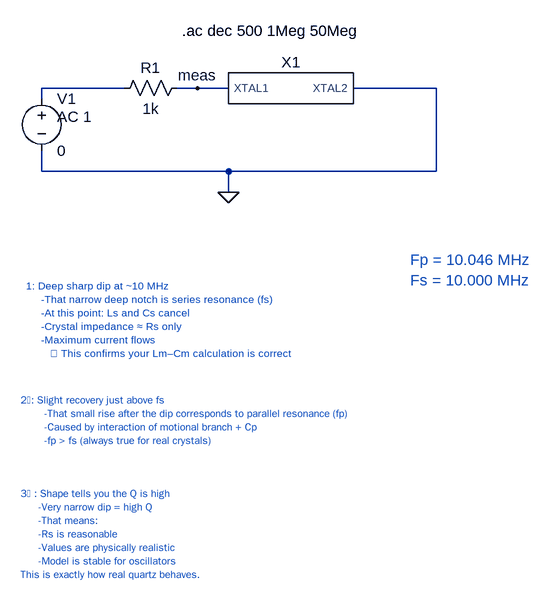
[diagram p0: schematic XTAL_10MHz_BVD__testing_AC_analysis.asc]
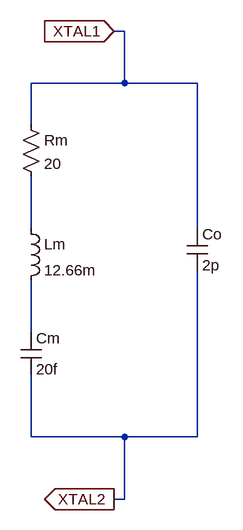
[diagram p1: sub-circuit xtal_10mhz_bvd.asc]
XTAL_10MHz_BVD__testing_AC_analysis.asc, the LTspice schematic file:
Version 4.1
SHEET 1 880 680
WIRE -1200 -1184 -1328 -1184
WIRE -1088 -1184 -1120 -1184
WIRE -1040 -1184 -1088 -1184
WIRE -720 -1184 -848 -1184
WIRE -1328 -1168 -1328 -1184
WIRE -1328 -1056 -1328 -1088
WIRE -1040 -1056 -1328 -1056
WIRE -720 -1056 -720 -1184
WIRE -720 -1056 -1040 -1056
WIRE -1040 -1024 -1040 -1056
FLAG -1040 -1024 0
FLAG -1088 -1184 meas
SYMBOL XTAL_10MHz_BVD -944 -1184 R0
SYMATTR InstName X1
SYMBOL voltage -1328 -1184 R0
WINDOW 123 24 44 Left 2
WINDOW 39 0 0 Left 0
SYMATTR InstName V1
SYMATTR Value 0
SYMATTR Value2 AC 1
SYMBOL res -1104 -1200 R90
WINDOW 0 0 56 VBottom 2
WINDOW 3 32 56 VTop 2
SYMATTR InstName R1
SYMATTR Value 1k
TEXT -1112 -1272 Left 2 !.ac dec 500 1Meg 50Meg
TEXT -1352 -880 Left 1 ;1: Deep sharp dip at ~10 MHz\n     -That narrow deep notch is series resonance (fs)\n     -At this point: Ls and Cs cancel\n     -Crystal impedance ≈ Rs only\n     -Maximum current flows\n        ✔ This confirms your Lm–Cm calculation is correct
TEXT -1360 -704 Left 1 ;2️: Slight recovery just above fs\n        -That small rise after the dip corresponds to parallel resonance (fp)\n        -Caused by interaction of motional branch + Cp\n        -fp > fs (always true for real crystals)
TEXT -1360 -560 Left 1 ;3️ : Shape tells you the Q is high\n      -Very narrow dip = high Q\n      -That means:\n      -Rs is reasonable\n      -Values are physically realistic\n      -Model is stable for oscillators\nThis is exactly how real quartz behaves.
TEXT -760 -920 Left 2 ;Fp = 10.046 MHz\nFs = 10.000 MHz

xtal_10mhz_bvd.asc, the sub-circuit schematic file:
Version 4.1
SHEET 1 880 712
WIRE 304 -80 288 -80
WIRE 304 0 304 -80
WIRE 304 0 160 0
WIRE 416 0 304 0
WIRE 160 64 160 0
WIRE 160 224 160 144
WIRE 416 224 416 0
WIRE 160 384 160 304
WIRE 160 544 160 448
WIRE 304 544 160 544
WIRE 416 544 416 288
WIRE 416 544 304 544
WIRE 304 640 304 544
WIRE 304 640 288 640
FLAG 288 -80 XTAL1
IOPIN 288 -80 In
FLAG 288 640 XTAL2
IOPIN 288 640 Out
SYMBOL res 144 48 R0
SYMATTR InstName Rm
SYMATTR Value 20
SYMBOL ind 144 208 R0
SYMATTR InstName Lm
SYMATTR Value 12.66m
SYMBOL cap 144 384 R0
SYMATTR InstName Cm
SYMATTR Value 20f
SYMBOL cap 400 224 R0
SYMATTR InstName Co
SYMATTR Value 2p

The netlist it stands for:
* XTAL_10MHz_BVD__testing_AC_analysis.asc
X§X1 meas 0 xtal_10mhz_bvd
V1 N001 0 0 AC 1
R1 meas N001 1k

* block symbol definitions
.subckt xtal_10mhz_bvd XTAL1 XTAL2
Rm XTAL1 N001 20
Lm N001 N002 12.66m
Cm N002 XTAL2 20f
Co XTAL1 XTAL2 2p
.ends xtal_10mhz_bvd

.ac dec 500 1Meg 50Meg
* 1: Deep sharp dip at ~10 MHz
*      -That narrow deep notch is series resonance (fs)
*      -At this point: Ls and Cs cancel
*      -Crystal impedance ≈ Rs only
*      -Maximum current flows
*         ✔ This confirms your Lm–Cm calculation is correct
* 2️: Slight recovery just above fs
*         -That small rise after the dip corresponds to parallel resonance (fp)
*         -Caused by interaction of motional branch + Cp
*         -fp > fs (always true for real crystals)
* 3️ : Shape tells you the Q is high
*       -Very narrow dip = high Q
*       -That means:
*       -Rs is reasonable
*       -Values are physically realistic
*       -Model is stable for oscillators
* This is exactly how real quartz behaves.
* Fp = 10.046 MHz
* Fs = 10.000 MHz
.backanno
.end

* Results of the author's LTspice run, read from the files saved beside the schematic
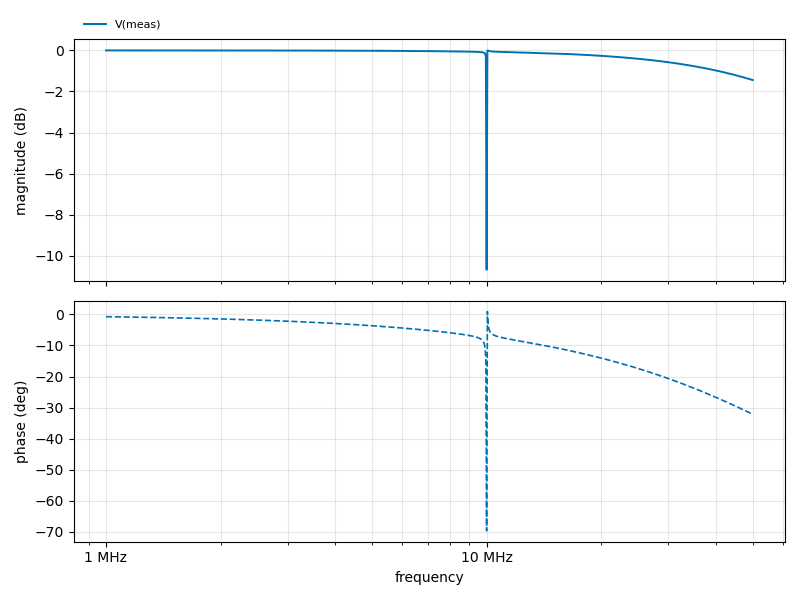
[diagram p2: AC Analysis of XTAL_10MHz_BVD__testing_AC_analysis.asc, plotted from the saved traces]
* AC Analysis, 1 run:
*   V(meas): -0.00 dB at 1 MHz, -1.44 dB at 50 MHz, peak -0.00 dB at 1 MHz, 3 dB below the peak at 9.966 MHz